# Altium schematic sheet 08_FPGA_D.SchDoc: FPGA Part D: Bank 7-8
size 381 x 266 mm; Organization: Meteroi; Address1: Room 428, 410 Guiping Rd.; Address2: Shanghai 200233, CHINA; SheetNumber: 9; SheetTotal: 11; PageSetup: Record=PageOptions|CenterHorizontal=True|CenterVertical=True|PrintScale=0.75|XCorrection=1.00|YCorrection=1.00|PrintKind=2|BorderSize=5000000|LeftOffset=0|BottomOffset=0|Orientation=2|PaperLength=1000|PaperWidth=1000|Scale=100|PaperSource=276|PrintQuality=-3|MediaType=1|DitherType=10|PaperKind=A4|PrintScaleMode=1
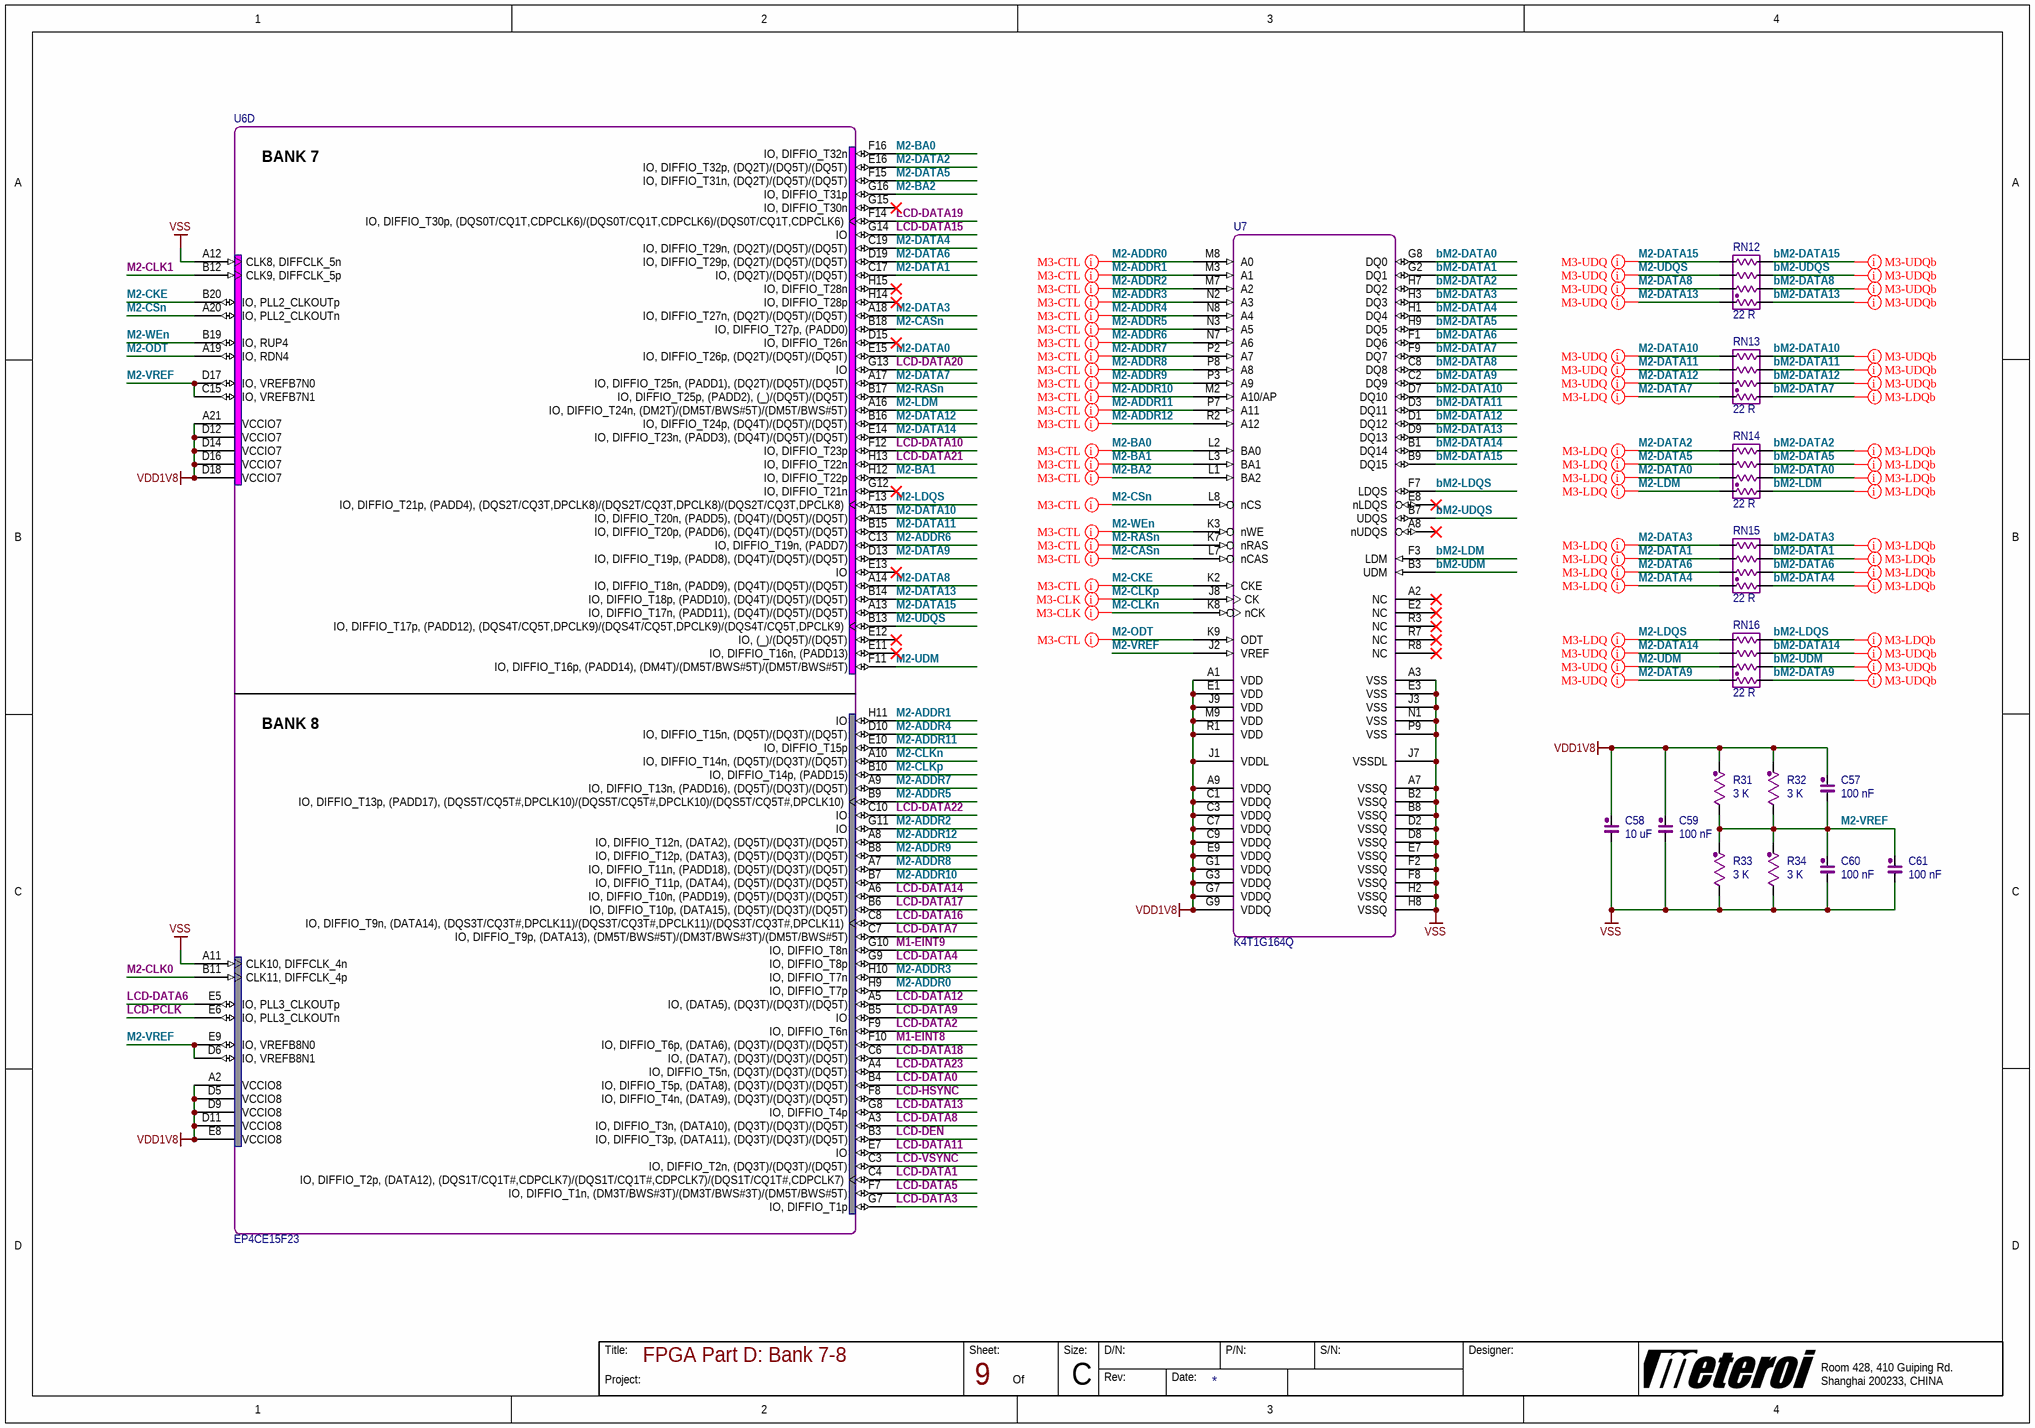
[diagram p0: 08_FPGA_D.SchDoc]

## Parts
C57  100 nF  [0402A1]
C58  10 uF  [0603A1]
C59  100 nF  [0402A1]
C60  100 nF  [0402A1]
C61  100 nF  [0402BG]
R31  3 K  [0402A2]
R32  3 K  [0402A2]
R33  3 K  [0402A2]
R34  3 K  [0402A2]
RN12  22 R  [0402PR4]
RN13  22 R  [0402PR4]
RN14  22 R  [0402PR4]
RN15  22 R  [0402PR4]
RN16  22 R  [0402PR4]
U6  EP4CE15F23  [FBGA-484]  (part D of 5)
U7  K4T1G164Q  [FBGA-DDR-84]

## Nets
VDD1V8: C57.2 C58.2 C59.2 R31.2 R32.2 U6.A2(VCCIO8) U6.A21(VCCIO7) U6.D5(VCCIO8) U6.D9(VCCIO8) U6.D11(VCCIO8) U6.D12(VCCIO7) U6.D14(VCCIO7) U6.D16(VCCIO7) U6.D18(VCCIO7) U6.E8(VCCIO8) U7.A1(VDD) U7.A9(VDDQ) U7.C1(VDDQ) U7.C3(VDDQ) U7.C7(VDDQ) U7.C9(VDDQ) U7.E1(VDD) U7.E9(VDDQ) U7.G1(VDDQ) U7.G3(VDDQ) U7.G7(VDDQ) U7.G9(VDDQ) U7.J1(VDDL) U7.J9(VDD) U7.M9(VDD) U7.R1(VDD)
VSS: C58.1 C59.1 C60.1 C61.1 R33.1 R34.1 U6.A11(CLK10,_DIFFCLK_4n) U6.A12(CLK8,_DIFFCLK_5n) U7.A3(VSS) U7.A7(VSSQ) U7.B2(VSSQ) U7.B8(VSSQ) U7.D2(VSSQ) U7.D8(VSSQ) U7.E3(VSS) U7.E7(VSSQ) U7.F2(VSSQ) U7.F8(VSSQ) U7.H2(VSSQ) U7.H8(VSSQ) U7.J3(VSS) U7.J7(VSSDL) U7.N1(VSS) U7.P9(VSS)
bM2-DATA0: RN14.4 U7.G8(DQ0)
bM2-DATA1: RN15.6 U7.G2(DQ1)
bM2-DATA2: RN14.8 U7.H7(DQ2)
bM2-DATA3: RN15.8 U7.H3(DQ3)
bM2-DATA4: RN15.2 U7.H1(DQ4)
bM2-DATA5: RN14.6 U7.H9(DQ5)
bM2-DATA6: RN15.4 U7.F1(DQ6)
bM2-DATA7: RN13.2 U7.F9(DQ7)
bM2-DATA8: RN12.4 U7.C8(DQ8)
bM2-DATA9: RN16.2 U7.C2(DQ9)
bM2-DATA10: RN13.8 U7.D7(DQ10)
bM2-DATA11: RN13.6 U7.D3(DQ11)
bM2-DATA12: RN13.4 U7.D1(DQ12)
bM2-DATA13: RN12.2 U7.D9(DQ13)
bM2-DATA14: RN16.6 U7.B1(DQ14)
bM2-DATA15: RN12.8 U7.B9(DQ15)
bM2-LDM: RN14.2 U7.F3(LDM)
bM2-LDQS: RN16.8 U7.F7(LDQS)
bM2-UDM: RN16.4 U7.B3(UDM)
bM2-UDQS: RN12.6 U7.B7(UDQS)
LCD-DATA0: U6.B4(IO,_DIFFIO_T5p,_(DATA8),_(DQ3T)/(DQ3T)/(DQ5T))
LCD-DATA1: U6.C4(IO,_DIFFIO_T2p,_(DATA12),_(DQS1T/CQ1T#,CDPCLK7)/(DQS1T/CQ1T#,CDPCLK7)/(DQS1T/CQ1T#,CDPCLK7))
LCD-DATA2: U6.F9(IO,_DIFFIO_T6n)
LCD-DATA3: U6.G7(IO,_DIFFIO_T1p)
LCD-DATA4: U6.G9(IO,_DIFFIO_T8p)
LCD-DATA5: U6.F7(IO,_DIFFIO_T1n,_(DM3T/BWS#3T)/(DM3T/BWS#3T)/(DM5T/BWS#5T))
LCD-DATA6: U6.E5(IO,_PLL3_CLKOUTp)
LCD-DATA7: U6.C7(IO,_DIFFIO_T9p,_(DATA13),_(DM5T/BWS#5T)/(DM3T/BWS#3T)/(DM5T/BWS#5T))
LCD-DATA8: U6.A3(IO,_DIFFIO_T3n,_(DATA10),_(DQ3T)/(DQ3T)/(DQ5T))
LCD-DATA9: U6.B5(IO)
LCD-DATA10: U6.F12(IO,_DIFFIO_T23p)
LCD-DATA11: U6.E7(IO)
LCD-DATA12: U6.A5(IO,_(DATA5),_(DQ3T)/(DQ3T)/(DQ5T))
LCD-DATA13: U6.G8(IO,_DIFFIO_T4p)
LCD-DATA14: U6.A6(IO,_DIFFIO_T10n,_(PADD19),_(DQ5T)/(DQ3T)/(DQ5T))
LCD-DATA15: U6.G14(IO)
LCD-DATA16: U6.C8(IO,_DIFFIO_T9n,_(DATA14),_(DQS3T/CQ3T#,DPCLK11)/(DQS3T/CQ3T#,DPCLK11)/(DQS3T/CQ3T#,DPCLK11))
LCD-DATA17: U6.B6(IO,_DIFFIO_T10p,_(DATA15),_(DQ5T)/(DQ3T)/(DQ5T))
LCD-DATA18: U6.C6(IO,_(DATA7),_(DQ3T)/(DQ3T)/(DQ5T))
LCD-DATA19: U6.F14(IO,_DIFFIO_T30p,_(DQS0T/CQ1T,CDPCLK6)/(DQS0T/CQ1T,CDPCLK6)/(DQS0T/CQ1T,CDPCLK6))
LCD-DATA20: U6.G13(IO)
LCD-DATA21: U6.H13(IO,_DIFFIO_T22n)
LCD-DATA22: U6.C10(IO)
LCD-DATA23: U6.A4(IO,_DIFFIO_T5n,_(DQ3T)/(DQ3T)/(DQ5T))
LCD-DEN: U6.B3(IO,_DIFFIO_T3p,_(DATA11),_(DQ3T)/(DQ3T)/(DQ5T))
LCD-HSYNC: U6.F8(IO,_DIFFIO_T4n,_(DATA9),_(DQ3T)/(DQ3T)/(DQ5T))
LCD-PCLK: U6.E6(IO,_PLL3_CLKOUTn)
LCD-VSYNC: U6.C3(IO,_DIFFIO_T2n,_(DQ3T)/(DQ3T)/(DQ5T))
M1-EINT8: U6.F10(IO,_DIFFIO_T6p,_(DATA6),_(DQ3T)/(DQ3T)/(DQ5T))
M1-EINT9: U6.G10(IO,_DIFFIO_T8n)
M2-ADDR0: U6.H9(IO,_DIFFIO_T7p) U7.M8(A0)
M2-ADDR1: U6.H11(IO) U7.M3(A1)
M2-ADDR2: U6.G11(IO) U7.M7(A2)
M2-ADDR3: U6.H10(IO,_DIFFIO_T7n) U7.N2(A3)
M2-ADDR4: U6.D10(IO,_DIFFIO_T15n,_(DQ5T)/(DQ3T)/(DQ5T)) U7.N8(A4)
M2-ADDR5: U6.B9(IO,_DIFFIO_T13p,_(PADD17),_(DQS5T/CQ5T#,DPCLK10)/(DQS5T/CQ5T#,DPCLK10)/(DQS5T/CQ5T#,DPCLK10)) U7.N3(A5)
M2-ADDR6: U6.C13(IO,_DIFFIO_T19n,_(PADD7)) U7.N7(A6)
M2-ADDR7: U6.A9(IO,_DIFFIO_T13n,_(PADD16),_(DQ5T)/(DQ3T)/(DQ5T)) U7.P2(A7)
M2-ADDR8: U6.A7(IO,_DIFFIO_T11n,_(PADD18),_(DQ5T)/(DQ3T)/(DQ5T)) U7.P8(A8)
M2-ADDR9: U6.B8(IO,_DIFFIO_T12p,_(DATA3),_(DQ5T)/(DQ3T)/(DQ5T)) U7.P3(A9)
M2-ADDR10: U6.B7(IO,_DIFFIO_T11p,_(DATA4),_(DQ5T)/(DQ3T)/(DQ5T)) U7.M2(A10/AP)
M2-ADDR11: U6.E10(IO,_DIFFIO_T15p) U7.P7(A11)
M2-ADDR12: U6.A8(IO,_DIFFIO_T12n,_(DATA2),_(DQ5T)/(DQ3T)/(DQ5T)) U7.R2(A12)
M2-BA0: U6.F16(IO,_DIFFIO_T32n) U7.L2(BA0)
M2-BA1: U6.H12(IO,_DIFFIO_T22p) U7.L3(BA1)
M2-BA2: U6.G16(IO,_DIFFIO_T31p) U7.L1(BA2)
M2-CASn: U6.B18(IO,_DIFFIO_T27p,_(PADD0)) U7.L7(nCAS)
M2-CKE: U6.B20(IO,_PLL2_CLKOUTp) U7.K2(CKE)
M2-CLK0: U6.B11(CLK11,_DIFFCLK_4p)
M2-CLK1: U6.B12(CLK9,_DIFFCLK_5p)
M2-CLKn: U6.A10(IO,_DIFFIO_T14n,_(DQ5T)/(DQ3T)/(DQ5T)) U7.K8(nCK)
M2-CLKp: U6.B10(IO,_DIFFIO_T14p,_(PADD15)) U7.J8(CK)
M2-CSn: U6.A20(IO,_PLL2_CLKOUTn) U7.L8(nCS)
M2-DATA0: RN14.3 U6.E15(IO,_DIFFIO_T26p,_(DQ2T)/(DQ5T)/(DQ5T))
M2-DATA1: RN15.5 U6.C17(IO,_(DQ2T)/(DQ5T)/(DQ5T))
M2-DATA2: RN14.7 U6.E16(IO,_DIFFIO_T32p,_(DQ2T)/(DQ5T)/(DQ5T))
M2-DATA3: RN15.7 U6.A18(IO,_DIFFIO_T27n,_(DQ2T)/(DQ5T)/(DQ5T))
M2-DATA4: RN15.1 U6.C19(IO,_DIFFIO_T29n,_(DQ2T)/(DQ5T)/(DQ5T))
M2-DATA5: RN14.5 U6.F15(IO,_DIFFIO_T31n,_(DQ2T)/(DQ5T)/(DQ5T))
M2-DATA6: RN15.3 U6.D19(IO,_DIFFIO_T29p,_(DQ2T)/(DQ5T)/(DQ5T))
M2-DATA7: RN13.1 U6.A17(IO,_DIFFIO_T25n,_(PADD1),_(DQ2T)/(DQ5T)/(DQ5T))
M2-DATA8: RN12.3 U6.A14(IO,_DIFFIO_T18n,_(PADD9),_(DQ4T)/(DQ5T)/(DQ5T))
M2-DATA9: RN16.1 U6.D13(IO,_DIFFIO_T19p,_(PADD8),_(DQ4T)/(DQ5T)/(DQ5T))
M2-DATA10: RN13.7 U6.A15(IO,_DIFFIO_T20n,_(PADD5),_(DQ4T)/(DQ5T)/(DQ5T))
M2-DATA11: RN13.5 U6.B15(IO,_DIFFIO_T20p,_(PADD6),_(DQ4T)/(DQ5T)/(DQ5T))
M2-DATA12: RN13.3 U6.B16(IO,_DIFFIO_T24p,_(DQ4T)/(DQ5T)/(DQ5T))
M2-DATA13: RN12.1 U6.B14(IO,_DIFFIO_T18p,_(PADD10),_(DQ4T)/(DQ5T)/(DQ5T))
M2-DATA14: RN16.5 U6.E14(IO,_DIFFIO_T23n,_(PADD3),_(DQ4T)/(DQ5T)/(DQ5T))
M2-DATA15: RN12.7 U6.A13(IO,_DIFFIO_T17n,_(PADD11),_(DQ4T)/(DQ5T)/(DQ5T))
M2-LDM: RN14.1 U6.A16(IO,_DIFFIO_T24n,_(DM2T)/(DM5T/BWS#5T)/(DM5T/BWS#5T))
M2-LDQS: RN16.7 U6.F13(IO,_DIFFIO_T21p,_(PADD4),_(DQS2T/CQ3T,DPCLK8)/(DQS2T/CQ3T,DPCLK8)/(DQS2T/CQ3T,DPCLK8))
M2-ODT: U6.A19(IO,_RDN4) U7.K9(ODT)
M2-RASn: U6.B17(IO,_DIFFIO_T25p,_(PADD2),_(_)/(DQ5T)/(DQ5T)) U7.K7(nRAS)
M2-UDM: RN16.3 U6.F11(IO,_DIFFIO_T16p,_(PADD14),_(DM4T)/(DM5T/BWS#5T)/(DM5T/BWS#5T))
M2-UDQS: RN12.5 U6.B13(IO,_DIFFIO_T17p,_(PADD12),_(DQS4T/CQ5T,DPCLK9)/(DQS4T/CQ5T,DPCLK9)/(DQS4T/CQ5T,DPCLK9))
M2-VREF: C57.1 C60.2 C61.2 R31.1 R32.1 R33.2 R34.2 U6.C15(IO,_VREFB7N1) U6.D6(IO,_VREFB8N1) U6.D17(IO,_VREFB7N0) U6.E9(IO,_VREFB8N0) U7.J2(VREF)
M2-WEn: U6.B19(IO,_RUP4) U7.K3(nWE)

Not connected (* = marked no-connect by the designer): U6 D15(IO,_DIFFIO_T26n)* E11(IO,_DIFFIO_T16n,_(PADD13))* E12(IO,_(_)/(DQ5T)/(DQ5T))* E13(IO)* G12(IO,_DIFFIO_T21n)* G15(IO,_DIFFIO_T30n)* H14(IO,_DIFFIO_T28p)* H15(IO,_DIFFIO_T28n)*; U7 A2(NC)* A8(nUDQS)* E2(NC)* E8(nLDQS)* R3(NC)* R7(NC)* R8(NC)*

## Layout directives
net class M3_CTL: M2-ADDR0, M2-ADDR1, M2-ADDR2, M2-ADDR3, M2-ADDR4, M2-ADDR5, M2-ADDR6, M2-ADDR7, M2-ADDR8, M2-ADDR9, M2-ADDR10, M2-ADDR11, M2-ADDR12, M2-BA0, M2-BA1, M2-BA2, M2-CASn, M2-CKE, M2-CSn, M2-ODT, M2-RASn, M2-WEn
net class M3-CLK: M2-CLKn, M2-CLKp
net class M3-UDQ: M2-DATA8, M2-DATA9, M2-DATA10, M2-DATA11, M2-DATA12, M2-DATA13, M2-DATA14, M2-DATA15, M2-UDM, M2-UDQS
net class M3-LDQ: M2-DATA0, M2-DATA1, M2-DATA2, M2-DATA3, M2-DATA4, M2-DATA5, M2-DATA6, M2-DATA7, M2-LDM, M2-LDQS
net class M3-LDQb: bM2-DATA0, bM2-DATA1, bM2-DATA2, bM2-DATA3, bM2-DATA4, bM2-DATA5, bM2-DATA6, bM2-DATA7, bM2-LDM, bM2-LDQS
net class M3-UDQb: bM2-DATA8, bM2-DATA9, bM2-DATA10, bM2-DATA11, bM2-DATA12, bM2-DATA13, bM2-DATA14, bM2-DATA15, bM2-UDM, bM2-UDQS

## Notes on the sheet
- Title:
- Project:
- Sheet:
- Of
- Size:
- D/N:
- Rev:
- Date:
- P/N:
- S/N:
- Designer:
- C
- (in symbol EP4CE15F23, part D) BANK 7; BANK 8

## Library data of the parts
C57 C59-C61 = CAP: Normal Capacitor; PartNumber: 0; Vendor: muRata; Designer: shyul; PinCountSMD: 2; Value: 100 nF; SerialNumber: 0; Publisher: Cowin; PCBMarker: Capacitor; Version: 1.0; VersionDate: 04-27-2011; PinCountHole: 0
C58 = CAP: Normal Capacitor; PartNumber: 0; Value: 100 nF; Vendor: muRata; Designer: shyul; PinCountSMD: 2; SerialNumber: 0; Publisher: Cowin; PCBMarker: Capacitor; Version: 1.0; VersionDate: 04-27-2011; PinCountHole: 0
R31-R34 = RES: Normal Resistor; PartNumber: 0; Vendor: KOA; Designer: shyul; PinCountSMD: 2; SerialNumber: 0; Value: 3 K; Version: 1.0; VersionDate: 04-27-2011; PCBMarker: Resistor; Publisher: Cowin; PinCountHole: 0
RN12-RN16 = RES_N4: Resistor Array x4; PartNumber: YC124-JR-0722RL; SerialNumber: 0; Vendor: YAGEO; Designer: shyul; PinCountSMD: 8; Value: 22 R; Version: 1.0; VersionDate: 04-27-2011; Publisher: Cowin; PCBMarker: Resistor Array; PinCountHole: 0
U6 = EP4CE15F23: Cyclone IV EP4CE15F23 FPGA; PartNumber: EP4CE15F23C8N; SerialNumber: 0; Vendor: Altera; Designer: shyul; PCBMarker: FPGA; Version: 1.0; VersionDate: 2-17-2012; Value: EP4CE15F23; Publisher: Cowin
U7 = K4T1G164Q: K4T1G164Q 64M x16 DDR2 SDRAM; PartNumber: K4T1G164QF-BCE7; SerialNumber: 0; Vendor: SUMSUNG; Designer: shyul; PCBMarker: DDR2; Version: 1.0; VersionDate: 2-16-2012; Value: K4T1G164Q; Publisher: Cowin